# Altium schematic sheet eCore_Main.SchDoc
size A
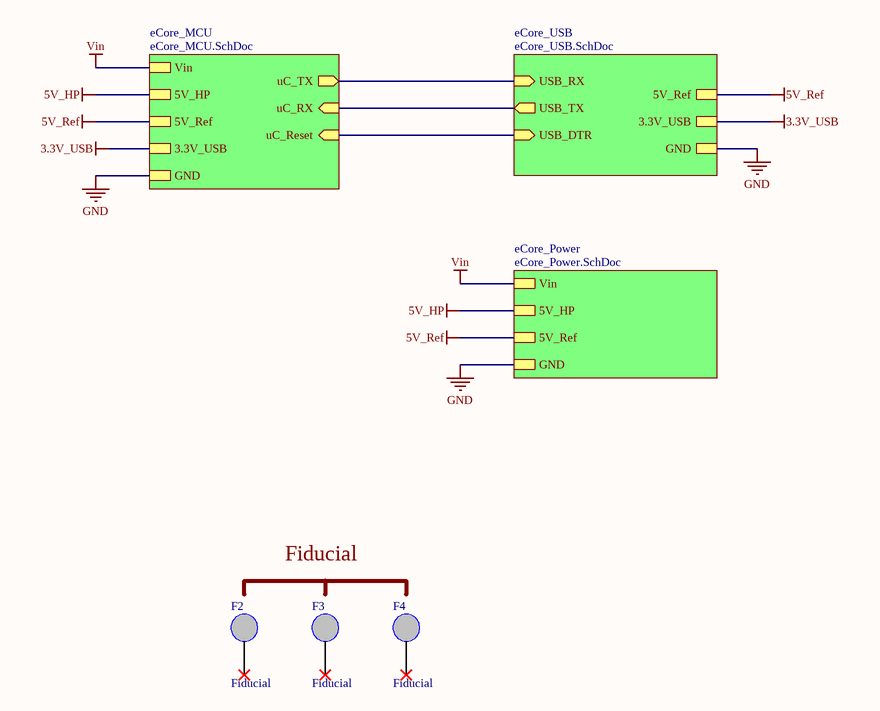
[diagram p0: eCore_Main.SchDoc]

## Parts
F2  Fiducial  [Fiducial]
F3  Fiducial  [Fiducial]
F4  Fiducial  [Fiducial]

## Sub-sheets
eCore_MCU = eCore_MCU.SchDoc: Vin, 5V_HP, 5V_Ref, 3.3V_USB, uC_RX (in), uC_TX (out), uC_Reset (in), GND
eCore_Power = eCore_Power.SchDoc: 5V_HP, 5V_Ref, Vin, GND
eCore_USB = eCore_USB.SchDoc: USB_RX (in), USB_TX (out), USB_DTR (in), 5V_Ref, GND, 3.3V_USB

## Nets
3.3V_USB: sheet eCore_MCU/3.3V_USB, sheet eCore_USB/3.3V_USB
5V_HP: sheet eCore_MCU/5V_HP, sheet eCore_Power/5V_HP
5V_Ref: sheet eCore_MCU/5V_Ref, sheet eCore_Power/5V_Ref, sheet eCore_USB/5V_Ref
GND: sheet eCore_MCU/GND, sheet eCore_Power/GND, sheet eCore_USB/GND
Vin: sheet eCore_MCU/Vin, sheet eCore_Power/Vin
(unnamed): sheet eCore_MCU/uC_RX, sheet eCore_USB/USB_TX
(unnamed): sheet eCore_MCU/uC_TX, sheet eCore_USB/USB_RX
(unnamed): sheet eCore_MCU/uC_Reset, sheet eCore_USB/USB_DTR

Not connected (* = marked no-connect by the designer): F2 Fiducial*; F3 Fiducial*; F4 Fiducial*

## Notes on the sheet
- Fiducial